# Altium schematic sheet dv_mcu_mem.SchDoc: =GlobalProjectName
size 209 x 297 mm; ApprovedBy: Утвердил; CheckedBy: Проверил; Author: Разработал; SheetNumber: 4; SheetTotal: 6; PageSetup: Record=PageOptions|CenterHorizontal=True|CenterVertical=True|PrintScale=1.00|XCorrection=1.00|YCorrection=1.00|PrintKind=1|BorderSize=5000000|LeftOffset=0|BottomOffset=0|Orientation=2|PaperLength=1000|PaperWidth=1000|Scale=100|PaperSource=15|PrintQuality=1200|MediaType=1|DitherType=10|PaperKind=A3|PrintScaleMode=1; Weight: -; ScaleFactor: -; NormInspection: Норм.Контр.
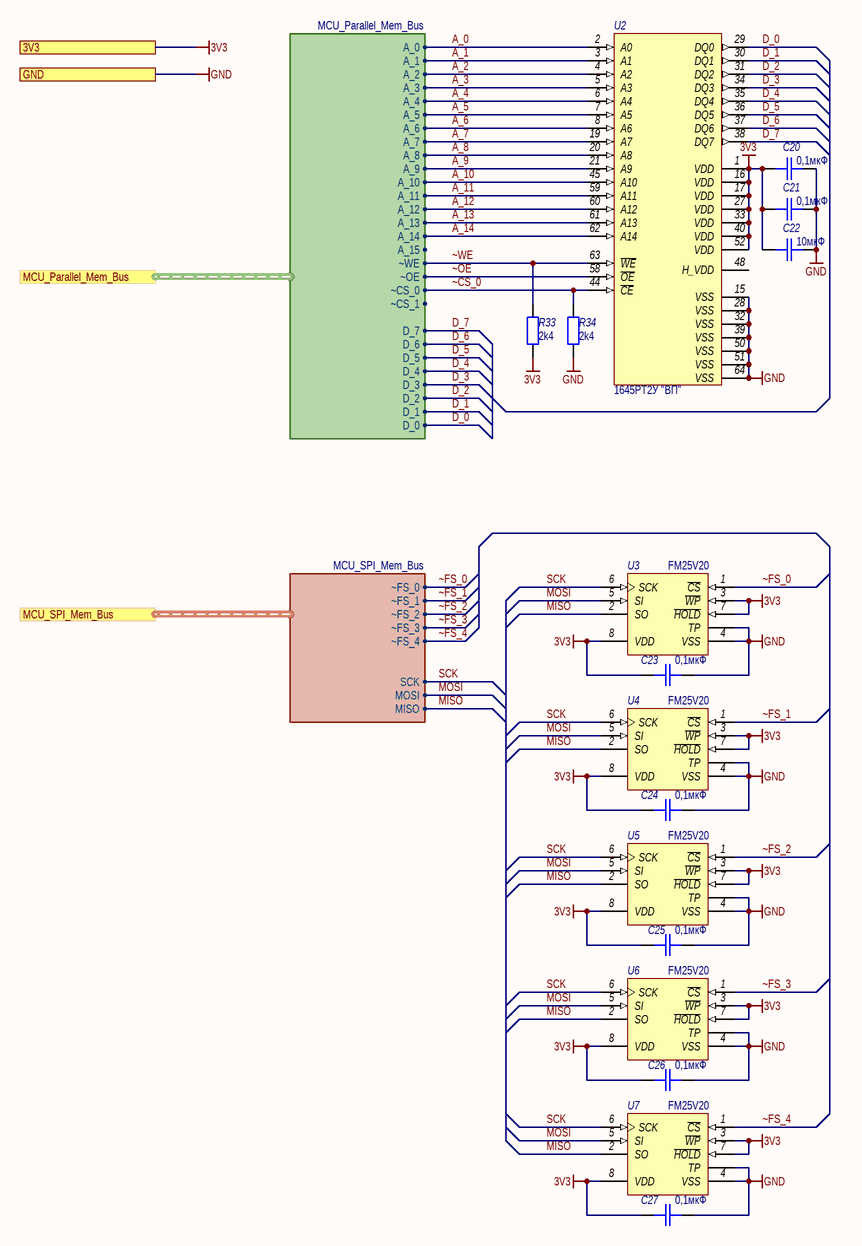
[diagram p0: dv_mcu_mem.SchDoc]

## Parts
C20  value 0,1мкФ  [SMD_C0805]  (hidden comment: K10-79)
C21  value 0,1мкФ  [SMD_C0805]  (hidden comment: K10-79)
C22  value 10мкФ  [SMD_C0805]  (hidden comment: K10-79)
C23  value 0,1мкФ  [SMD_C0805]  (hidden comment: K10-79)
C24  value 0,1мкФ  [SMD_C0805]  (hidden comment: K10-79)
C25  value 0,1мкФ  [SMD_C0805]  (hidden comment: K10-79)
C26  value 0,1мкФ  [SMD_C0805]  (hidden comment: K10-79)
C27  value 0,1мкФ  [SMD_C0805]  (hidden comment: K10-79)
R33  value 2k4  [SMD_0805]  (hidden comment: OSM R1-12)
R34  value 2k4  [SMD_0805]  (hidden comment: OSM R1-12)
U2  Наименование: 1645РТ2У "ВП"  [5134.64-6]  (hidden comment: 1645RT2U VP)
U3  FM25V20  [TDFN-8_6x5]
U4  FM25V20  [TDFN-8_6x5]
U5  FM25V20  [TDFN-8_6x5]
U6  FM25V20  [TDFN-8_6x5]
U7  FM25V20  [TDFN-8_6x5]

## Ports
3V3, GND, MCU_Parallel_Mem_Bus (harness MCU_Parallel_Mem_Bus), MCU_SPI_Mem_Bus (harness MCU_SPI_Mem_Bus)

## Harnesses
MCU_Parallel_Mem_Bus: D_0, ~CS_0, ~OE, ~WE, ~CS_1, D_1, D_2, D_7, D_3, D_4, D_5, D_6, A_0, A_1, A_2, A_3, A_4, A_5, A_6, A_7, A_8, A_9, A_10, A_11, A_12, A_13, A_14, A_15
MCU_SPI_Mem_Bus: ~FS_4, MISO, ~FS_0, SCK, MOSI, ~FS_1, ~FS_2, ~FS_3

## Nets
3V3: C20.1 C21.1 C22.2 C23.2 C24.2 C25.2 C26.2 C27.2 R33.1 U2.1(VDD) U2.16(VDD) U2.17(VDD) U2.27(VDD) U2.33(VDD) U2.40(VDD) U2.52(VDD) U3.3(~{WP}) U3.7(~{HOLD}) U3.8(VDD) U4.3(~{WP}) U4.7(~{HOLD}) U4.8(VDD) U5.3(~{WP}) U5.7(~{HOLD}) U5.8(VDD) U6.3(~{WP}) U6.7(~{HOLD}) U6.8(VDD) U7.3(~{WP}) U7.7(~{HOLD}) U7.8(VDD) ; port 3V3
GND: C20.2 C21.2 C22.1 C23.1 C24.1 C25.1 C26.1 C27.1 R34.1 U2.15(VSS) U2.28(VSS) U2.32(VSS) U2.39(VSS) U2.50(VSS) U2.51(VSS) U2.64(VSS) U3.4(VSS) U3.TP U4.4(VSS) U4.TP U5.4(VSS) U5.TP U6.4(VSS) U6.TP U7.4(VSS) U7.TP ; port GND
A_0: U2.2(A0) ; port MCU_Parallel_Mem_Bus.A_0
A_1: U2.3(A1) ; port MCU_Parallel_Mem_Bus.A_1
A_2: U2.4(A2) ; port MCU_Parallel_Mem_Bus.A_2
A_3: U2.5(A3) ; port MCU_Parallel_Mem_Bus.A_3
A_4: U2.6(A4) ; port MCU_Parallel_Mem_Bus.A_4
A_5: U2.7(A5) ; port MCU_Parallel_Mem_Bus.A_5
A_6: U2.8(A6) ; port MCU_Parallel_Mem_Bus.A_6
A_7: U2.19(A7) ; port MCU_Parallel_Mem_Bus.A_7
A_8: U2.20(A8) ; port MCU_Parallel_Mem_Bus.A_8
A_9: U2.21(A9) ; port MCU_Parallel_Mem_Bus.A_9
A_10: U2.45(A10) ; port MCU_Parallel_Mem_Bus.A_10
A_11: U2.59(A11) ; port MCU_Parallel_Mem_Bus.A_11
A_12: U2.60(A12) ; port MCU_Parallel_Mem_Bus.A_12
A_13: U2.61(A13) ; port MCU_Parallel_Mem_Bus.A_13
A_14: U2.62(A14) ; port MCU_Parallel_Mem_Bus.A_14
D_0: U2.29(DQ0) ; port MCU_Parallel_Mem_Bus.D_0
D_1: U2.30(DQ1) ; port MCU_Parallel_Mem_Bus.D_1
D_2: U2.31(DQ2) ; port MCU_Parallel_Mem_Bus.D_2
D_3: U2.34(DQ3) ; port MCU_Parallel_Mem_Bus.D_3
D_4: U2.35(DQ4) ; port MCU_Parallel_Mem_Bus.D_4
D_5: U2.36(DQ5) ; port MCU_Parallel_Mem_Bus.D_5
D_6: U2.37(DQ6) ; port MCU_Parallel_Mem_Bus.D_6
D_7: U2.38(DQ7) ; port MCU_Parallel_Mem_Bus.D_7
MISO: U3.2(SO) U4.2(SO) U5.2(SO) U6.2(SO) U7.2(SO) ; port MCU_SPI_Mem_Bus.MISO
MOSI: U3.5(SI) U4.5(SI) U5.5(SI) U6.5(SI) U7.5(SI) ; port MCU_SPI_Mem_Bus.MOSI
SCK: U3.6(SCK) U4.6(SCK) U5.6(SCK) U6.6(SCK) U7.6(SCK) ; port MCU_SPI_Mem_Bus.SCK
~CS_0: R34.2 U2.44(~{CE}) ; port MCU_Parallel_Mem_Bus.~CS_0
~FS_0: U3.1(~{CS}) ; port MCU_SPI_Mem_Bus.~FS_0
~FS_1: U4.1(~{CS}) ; port MCU_SPI_Mem_Bus.~FS_1
~FS_2: U5.1(~{CS}) ; port MCU_SPI_Mem_Bus.~FS_2
~FS_3: U6.1(~{CS}) ; port MCU_SPI_Mem_Bus.~FS_3
~FS_4: U7.1(~{CS}) ; port MCU_SPI_Mem_Bus.~FS_4
~OE: U2.58(~{OE}) ; port MCU_Parallel_Mem_Bus.~OE
~WE: R33.2 U2.63(~{WE}) ; port MCU_Parallel_Mem_Bus.~WE

Not connected (* = marked no-connect by the designer): U2 48(H_VDD)

## Notes on the sheet
- Подп. и дата
- Инв. № дубл.
- Взам. инв. №
- Инв. № подл.
- Изм.
- Лист
- № докум.
- Подп.
- Дата
- Форма 2а ГОСТ 2.104-2006
- Копировал
- Формат А4

## Library data of the parts
C20-C27 = Capacitor: Назначение: SMD-конденсатор; Наименование: К10-79; Потребление, Вт: 0; Напряжение: В; Точность: %
R33 R34 = Resistor: Наименование: ОСМ Р1-12; Назначение: SMD-резистор; Потребление, Вт: 0,001; Точность: %
U2 = 1645RT2U: Микросхема однократно программируемого постоянного / запоминающего устройства ёмкостью 256 К с организацией 32Кх8 / 1645РТ2У; Назначение: ОППЗУ; Потребление, Вт: 0.330; ComponentLink1Description: DataSheet; ComponentLink1URL: https://forum.milandr.ru/download/file.php?id=473
U3-U7 = FM25V: 2Mb Serial 3V FRAM Memory; Потребление, Вт: 0,009; Назначение: 2Mb Serial 3V FRAM Memory; ComponentLink1Description: Datasheet; ComponentLink1URL: https://www.cypress.com/file/136456/download; Наименование: FM25V20